# EAGLE design PIC V.1 (EAGLE 9.6.2)
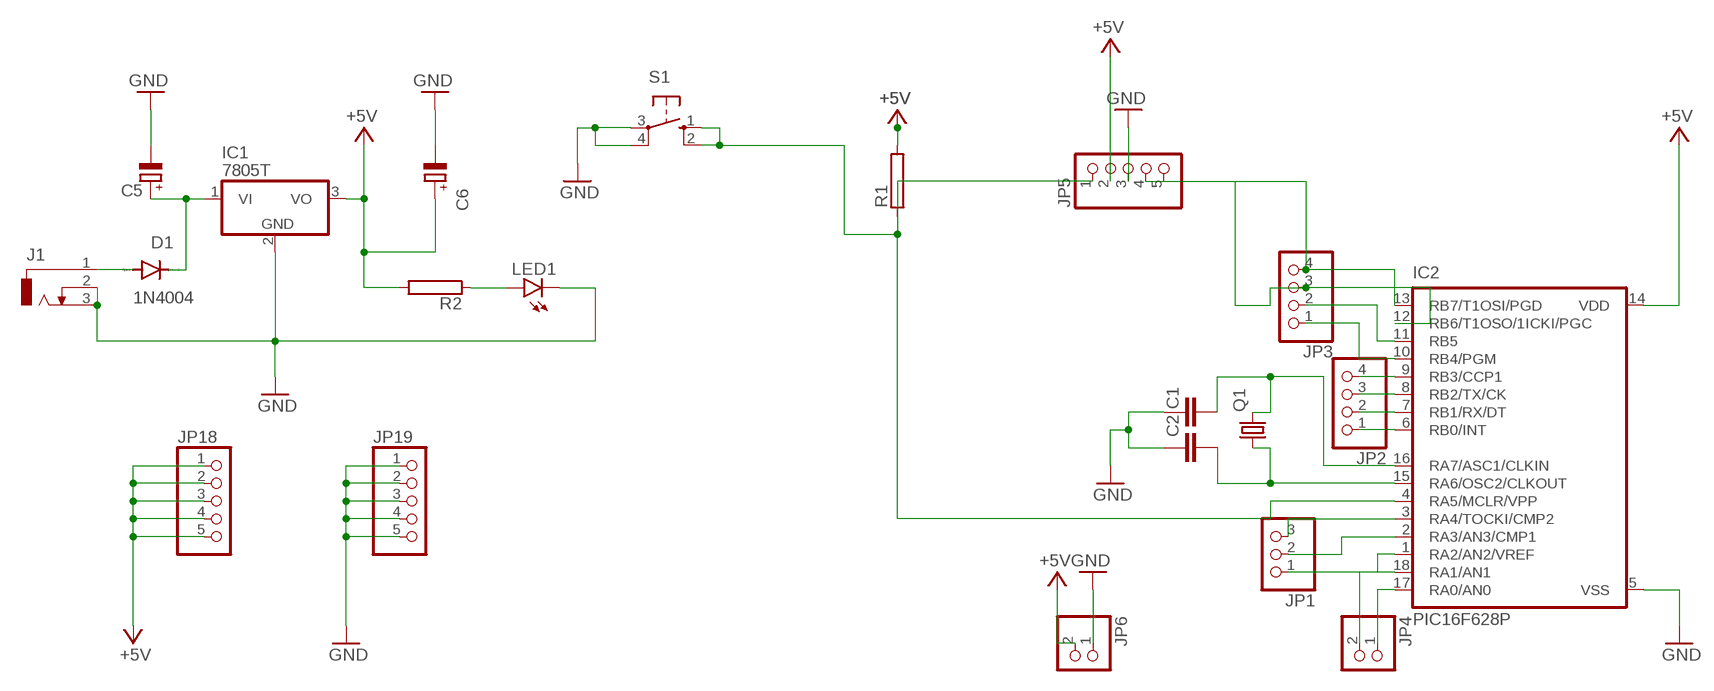
[diagram p0: schematic, sheet 1]

## Parts
C1  C2.5/2  [C2.5-2]
C2  C2.5/2  [C2.5-2]
C5  CPOL-EUE2,5-6E  [E2,5-6E]
C6  CPOL-EUE2,5-6E  [E2,5-6E]
D1  1N4004  [DO41-10]
IC1  7805T  [TO220H]
IC2  PIC16F628P  [DIL18]
J1  DCJ0303  [DCJ0303]
JP1  PINHD-1X3  [1X03]
JP2  PINHD-1X4  [1X04]
JP3  PINHD-1X4  [1X04]
JP4  PINHD-1X2  [1X02]
JP5  PINHD-1X5  [1X05]
JP6  PINHD-1X2  [1X02]
JP18  PINHD-1X5  [1X05]
JP19  PINHD-1X5  [1X05]
LED1  LED5MM  [LED5MM]
Q1  CRYSTALHC49U-V  [HC49U-V]
R1  RRS1/4  [RS1/4]
R2  RRS1/4  [RS1/4]
S1  10-XX  [B3F-10XX]

## Nets
+5V: C6.+ IC1.3(VO) IC2.14(VDD) JP5.2 JP6.2 JP18.1 JP18.2 JP18.3 JP18.4 JP18.5 R1.2 R2.2
GND: C1.1 C2.1 C5.- C6.- IC1.2(GND) IC2.5(VSS) J1.2 J1.3 JP5.3 JP6.1 JP19.1 JP19.2 JP19.3 JP19.4 JP19.5 LED1.K(C) S1.3(P) S1.4(P1)
N$1: IC2.1(RA2/AN2/VREF) JP1.1
N$2: IC2.2(RA3/AN3/CMP1) JP1.2
N$3: IC2.3(RA4/TOCKI/CMP2) JP1.3
N$4: IC2.6(RB0/INT) JP2.1
N$5: IC2.7(RB1/RX/DT) JP2.2
N$6: IC2.8(RB2/TX/CK) JP2.3
N$7: IC2.9(RB3/CCP1) JP2.4
N$8: IC2.10(RB4/PGM) JP3.1
N$9: IC2.11(RB5) JP3.2
N$10: IC2.12(RB6/T1OSO/1ICKI/PGC) JP3.3 JP5.5
N$11: IC2.13(RB7/T1OSI/PGD) JP3.4 JP5.4
N$12: IC2.17(RA0/AN0) JP4.1
N$13: IC2.18(RA1/AN1) JP4.2
N$25: C2.2 IC2.15(RA6/OSC2/CLKOUT) Q1.1
N$26: IC2.4(RA5/MCLR/VPP) JP5.1 R1.1 S1.1(S) S1.2(S1)
N$28: C1.2 IC2.16(RA7/ASC1/CLKIN) Q1.2
N$30: C5.+ D1.C IC1.1(VI)
N$32: LED1.A R2.1
N$33: D1.A J1.1

## Library data of the parts
C1 C2 = capacitor-wima:C: CAPACITOR naming: grid - package width
C5 C6 = rcl:CPOL-EU: POLARIZED CAPACITOR, European symbol; SPICEPREFIX: C
D1 = diode:1N4004: DIODE general purpose rectifier, 1 A
IC1 = linear:78*: Positive VOLTAGE REGULATOR Source: http://cache.national.com/ds/LM/LM78L05.pdf http://www.fairchildsemi.com/ds/LM/LM7805.pdf
IC2 = microchip:PIC16*F62: FLASH-Based 8-Bit CMOS Microcontroller Source: http://ww1.microchip.com/downloads/en/DeviceDoc/40300C.pdf; MF: MICROCHIP; MPN: PIC16F628-20/P; OC_FARNELL: 9760423; OC_NEWARK: 23C4982
J1 = con-jack:DCJ0303: DC POWER JACK Source: DCJ0303.pdf; OC_FARNELL: unknown; OC_NEWARK: unknown
JP1 = pinhead:PINHD-1X3: PIN HEADER
JP2 JP3 = pinhead:PINHD-1X4: PIN HEADER
JP4 JP6 = pinhead:PINHD-1X2: PIN HEADER
JP5 JP18 JP19 = pinhead:PINHD-1X5: PIN HEADER
LED1 = led:LED: LED OSRAM: - CHIPLED LG R971, LG N971, LY N971, LG Q971, LY Q971, LO R971, LY R971 LH N974, LH R974 LS Q976, LO Q976, LY Q976 LO Q996 - Hyper CHIPLED LW Q18S LB Q993, LB Q99A, LB R99A - SideLED LS A670, LO A670, LY A670, LG A670, LP A670 LB A673, LV A673, LT A673, LW A673 LH A674 LY A675 LS A676, LA A676, LO A676, LY A676, LW A676 LS A679, LY A679, LG A679 - Hyper Micro SIDELED® LS Y876, LA Y876, LO Y876, LY Y876 LT Y87S - SmartLED LW L88C, LW L88S LB L89C, LB L89S, LG L890 LS L89K, LO L89K, LY L89K LS L896, LA L896, LO L896, LY L896 - TOPLED LS T670, LO T670, LY T670, LG T670, LP T670 LSG T670, LSP T670, LSY T670, LOP T670, LYG T670 LG T671, LOG T671, LSG T671 LB T673, LV T673, LT T673, LW T673 LH T674 LS T676, LA T676, LO T676, LY T676, LB T676, LH T676, LSB T676, LW T676 LB T67C, LV T67C, LT T67C, LS T67K, LO T67K, LY T67K, LW E67C LS E67B, LA E67B, LO E67B, LY E67B, LB E67C, LV E67C, LT E67C LW T67C LS T679, LY T679, LG T679 LS T770, LO T770, LY T770, LG T770, LP T770 LB T773, LV T773, LT T773, LW T773 LH T774 LS E675, LA E675, LY E675, LS T675 LS T776, LA T776, LO T776, LY T776, LB T776 LHGB T686 LT T68C, LB T68C - Hyper Mini TOPLED® LB M676 - Mini TOPLED Santana® LG M470 LS M47K, LO M47K, LY M47K Source: http://www.osram.convergy.de LUXEON: - LUMILED® LXK2-PW12-R00, LXK2-PW12-S00, LXK2-PW14-U00, LXK2-PW14-V00 LXK2-PM12-R00, LXK2-PM12-S00, LXK2-PM14-U00 LXK2-PE12-Q00, LXK2-PE12-R00, LXK2-PE12-S00, LXK2-PE14-T00, LXK2-PE14-U00 LXK2-PB12-K00, LXK2-PB12-L00, LXK2-PB12-M00, LXK2-PB14-N00, LXK2-PB14-P00, LXK2-PB14-Q00 LXK2-PR12-L00, LXK2-PR12-M00, LXK2-PR14-Q00, LXK2-PR14-R00 LXK2-PD12-Q00, LXK2-PD12-R00, LXK2-PD12-S00 LXK2-PH12-R00, LXK2-PH12-S00 LXK2-PL12-P00, LXK2-PL12-Q00, LXK2-PL12-R00 Source: www.luxeon.com KINGBRIGHT: KA-3528ASYC Source: www.kingbright.com
Q1 = crystal:CRYSTAL: CRYSTAL; OC_FARNELL: 1666969; OC_NEWARK: unknown
R1 R2 = resistor-power:R: Power Resitor; MF: OHMITE; MPN: RRS1K0; OC_FARNELL: unknown; OC_NEWARK: 01F7661
S1 = switch-omron:10-XX: OMRON SWITCH; MPN: B3F-1000; OC_FARNELL: 176432; OC_NEWARK: 36M3542

## Board
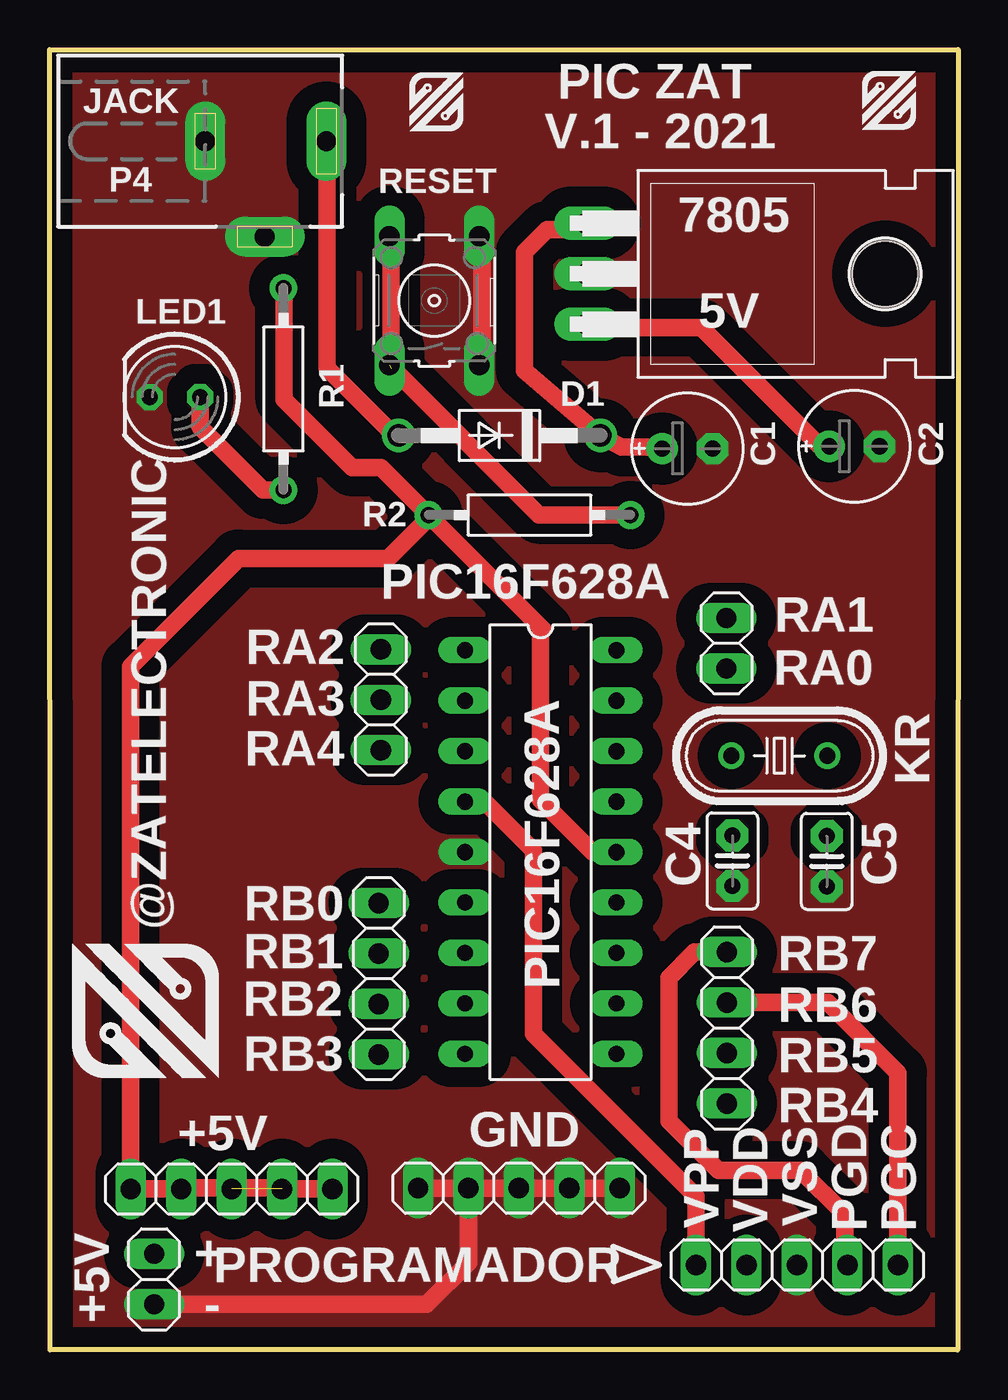
[diagram p1: board, top side]
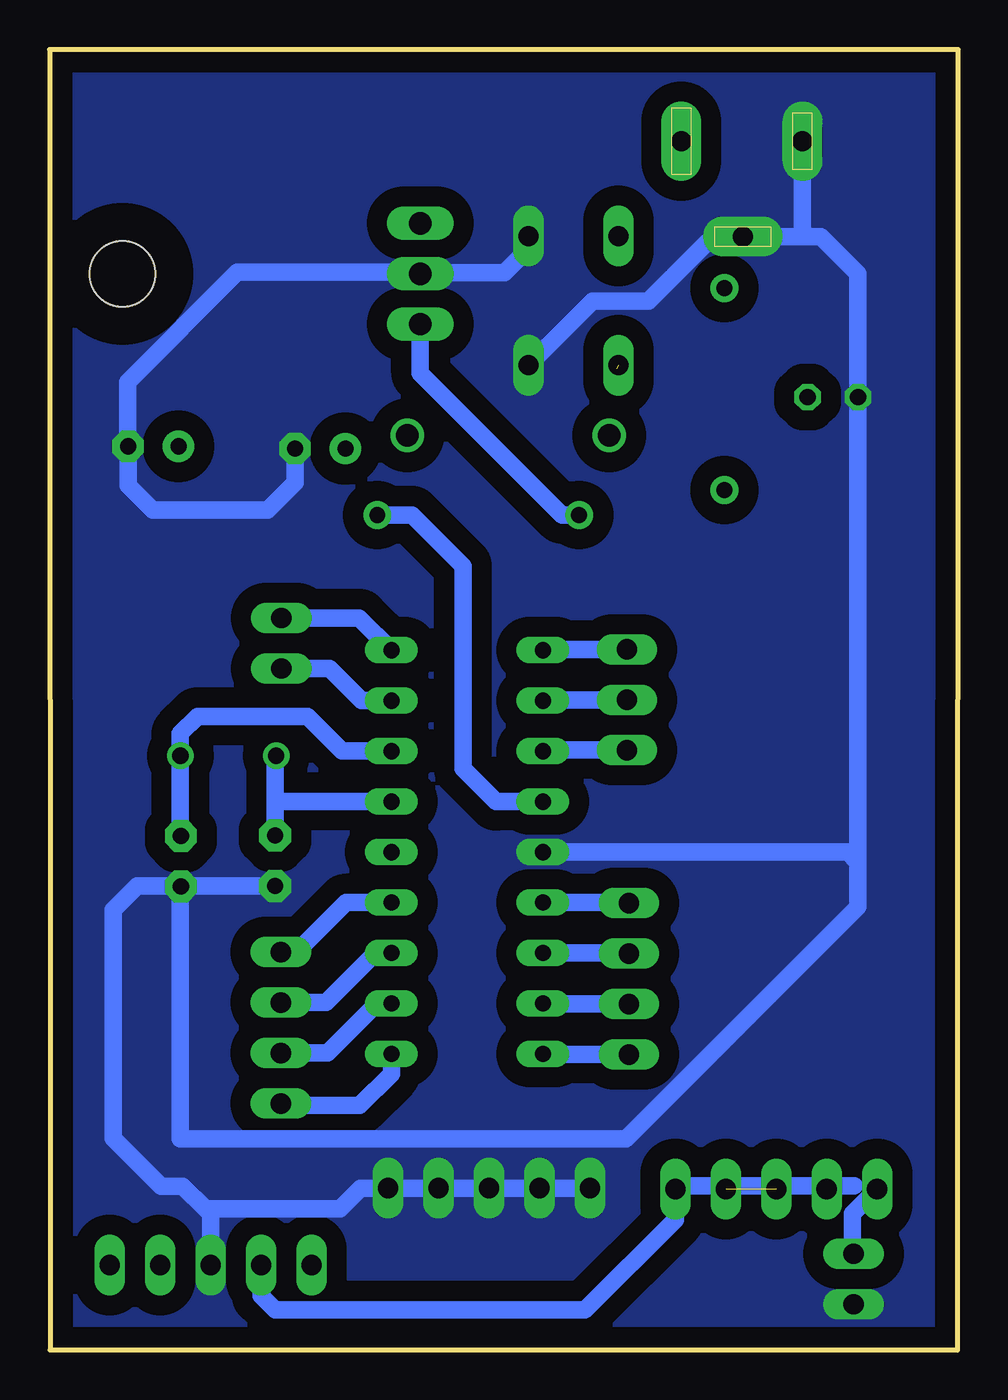
[diagram p2: board, bottom side, seen from below]

Size 45.72 x 65.43 mm. Coordinates in mm from the lower left corner, seen from the top.
Outline: 0,65.43 45.72,65.43 45.69,0 0.03,0 0,65.43
Copper layers (1*16): Top 0.035mm / dielectric 1.5mm / Bottom 0.035mm
Design rules "default *": minimum track width 35mil, minimum drill 0.35mm, track to track 6mil, track to pad 6mil, pad to pad 6mil, via to via 6mil, smd to smd 6mil, copper to edge 40mil, drill to drill 6mil, minimum pad ring 10mil, minimum via ring 8mil, stop-mask expansion 4mil, vias tented up to drill 0mil, thermal gap 10mil

### Footprints (pad centres in the part's own frame; a part is rotated, then mirrored left to right if it is on the bottom)
C2.5-2 = drill 0.813 pad 1.6 octagon: 1 -1.27,0; 2 1.27,0
E2,5-6E = drill 0.813 pad 1.575: + -1.27,0 | drill 0.813 pad 1.575 octagon: - 1.27,0
DO41-10 = drill 1.118: A 5.08,0; C -5.08,0
TO220H = drill 1.118 long: 1 -2.54,-10.16; 2 0,-10.16; 3 2.54,-10.16 | hole 3.302: 0,4.826
DIL18 = drill 0.813 long: 1 -10.16,-3.81; 2 -7.62,-3.81; 3 -5.08,-3.81; 4 -2.54,-3.81; 5 0,-3.81; 6 2.54,-3.81; 7 5.08,-3.81; 8 7.62,-3.81; 9 10.16,-3.81; 10 10.16,3.81; 11 7.62,3.81; 12 5.08,3.81; 13 2.54,3.81; 14 0,3.81; 15 -2.54,3.81; 16 -5.08,3.81; 17 -7.62,3.81; 18 -10.16,3.81
DCJ0303 = drill 1 pad 2 long: 1 0,3.1; 2 4.8,0; 3 0,-3
1X03 = drill 1.016 long: 1 -2.54,0; 2 0,0; 3 2.54,0
1X04 = drill 1.016 long: 1 -3.81,0; 2 -1.27,0; 3 1.27,0; 4 3.81,0
1X02 = drill 1.016 long: 1 -1.27,0; 2 1.27,0
1X05 = drill 1.016 long: 1 -5.08,0; 2 -2.54,0; 3 0,0; 4 2.54,0; 5 5.08,0
LED5MM = drill 0.813 octagon: A -1.27,0; K 1.27,0
HC49U-V = drill 0.813: 1 -2.413,0; 2 2.413,0
RS1/4 = drill 0.8 pad 1.4: 1 -5.08,0; 2 5.08,0
B3F-10XX = drill 1.016 long: 1 -3.251,2.261; 2 3.251,2.261; 3 -3.251,-2.261; 4 3.251,-2.261

### Placement (x,y rotation side)
C1  39.12,24.59 90 top
C2  34.37,24.61 90 top
C5  32.1,45.36 0 top
C6  40.5,45.47 0 top
D1  22.64,46.02 180 top
IC1  37.23,54.15 270 top
IC2  24.71,25.05 270 top
J1  10.83,60.83 270 top
JP1  16.66,32.72 270 top
JP2  16.56,18.67 270 top
JP3  34.09,16.21 90 top
JP4  34.06,35.56 90 top
JP5  37.62,4.27 0 top
JP6  5.26,3.56 90 top
JP18  9.15,8.09 0 top
JP19  23.61,8.14 0 top
LED1  6.3,47.95 180 top
Q1  36.73,29.9 0 top
R1  24.15,42.01 180 top
R2  11.77,48.35 90 top
S1  19.36,52.8 90 top
U$1  [LOGO_ZATELECTRONIC1.25CM]  9.12,13.28 90 top
U$2  [SIMBOLO_PEQUENO]  17.96,61.09 0 top
U$3  [SIMBOLO_PEQUENO]  40.74,61.16 0 top

### Tracks (layer width: path | path; a pad name or v marks a point on that pad's centre or on a via)
+5V  (1 unrouted)
  Top 0.889: R2.2 11.81,53.42 11.81,47.83 15.22,44.41 16.67,44.41 R1.2 | IC1.3 27.25,51.43 32.8,51.43 38.76,45.47 C6.+ | R1.2 19.04,41.98 | 24.84,36.24 24.71,36.37 | 24.71,36.37 R1.2 | JP18.5 JP18.4 11.63,8.15 6.67,8.15 JP18.2 JP18.1 4.07,34.4 9.5,39.83 17.04,39.83 19.07,41.85 R1.2 | IC2.14 27.33,25.05 24.71,27.66 24.71,36.37
  Bottom 0.889: R1.2 19.93,42.02 27.07,49.15 IC1.3 | 5.21,8.25 14.08,8.25 JP18.5 14.23,6.55 18.77,2.01 34.37,2.01 35.08,2.72 JP5.2 | 4.22,8.25 JP18.1 5.32,6.85 5.32,4.88 JP6.2
GND
  Top 0.889: S1.4 21.75,55.92 21.75,49.69 | J1.2 9.64,56.03 | JP19.1 JP19.2 | JP19.2 JP19.3 JP19.4 JP19.5 | JP6.1 18.97,2.29 21.07,4.39 JP19.2
  Bottom 0.889: S1.4 21.62,55.41 22.82,54.21 26.96,54.21 IC1.2 27.14,54.22 36.29,54.22 41.8,48.71 41.8,45.5 C6.- 41.77,43.49 40.53,42.25 34.76,42.25 33.37,43.64 C5.- | S1.3 18.39,52.78 15.58,52.78 12.26,56.1 10.9,56.1 J1.2 7.69,56.03 | 7.69,56.03 6.91,56.03 5.03,54.15 LED1.K 5.03,24.54 | J1.3 7.83,56.17 7.69,56.03 | 5.03,24.54 5.03,22.3 16.71,10.62 39.14,10.62 39.14,23.29 C1.1 39.09,23.34 | IC2.5 5.54,25.05 5.03,24.54 | C2.1 39.09,23.34 | JP5.3 37.62,6.83 37.87,7.09 | 39.09,23.34 41.33,23.34 42.52,22.15 42.52,10.64 40.11,8.23 39.01,8.23 37.87,7.09 | 37.87,7.09 31.12,7.09 30.06,8.14 JP19.5 JP19.1
  pour Bottom (isolate 1.016, no thermals): 0.08,65.61 0.08,-0.2 45.62,-0.2 45.62,65.61
  pour Top (isolate 1.016, no thermals): 0,65.51 0,0.03 45.69,0.03 45.69,65.51
N$1
  Bottom 0.889: JP1.1 20.85,35.26 IC2.1
N$2
  Bottom 0.889: JP1.2 20.85,32.72 IC2.2
N$3
  Bottom 0.889: JP1.3 20.85,30.17 IC2.3
N$4
  Bottom 0.889: IC2.6 16.59,22.51 JP2.1
N$5
  Bottom 0.889: IC2.7 16.59,19.97 JP2.2
N$6
  Bottom 0.889: JP2.3 20.87,17.4 IC2.8
N$7
  Bottom 0.889: JP2.4 20.87,14.86 IC2.9
N$8
  Bottom 0.889: IC2.10 28.52,13.9 30.12,12.29 33.99,12.29 JP3.1
N$9
  Bottom 0.889: IC2.11 29.23,17.43 31.72,14.93 JP3.2
N$10
  Top 0.889: JP5.5 42.7,13.95 39.17,17.48 JP3.3
  Bottom 0.889: IC2.12 29.31,19.97 31.8,17.48 JP3.3
N$11
  Top 0.889: JP5.4 40.02,4.41 40.02,6.81 37.79,9.04 33.66,9.04 31.17,11.53 31.17,18.72 32.46,20.02 JP3.4
  Bottom 0.889: IC2.13 30.81,22.51 33.4,19.91 34.7,19.91 34.59,20.02 JP3.4
N$12
  Bottom 0.889: IC2.17 30.02,32.67 31.64,34.29 34.22,34.29 34.21,34.29 JP4.1
N$13
  Bottom 0.889: IC2.18 30.14,36.83 JP4.2
N$25
  Bottom 0.889: Q1.1 34.37,29.84 34.37,27.69 | 34.37,27.69 C2.2 | IC2.15 34.27,27.59 34.37,27.69
N$26  (1 unrouted)
  Top 0.889: 17.18,49.38 17.18,55.98 S1.2 | 17.27,49.72 S1.1 24.63,42.02 R1.1 | JP5.1 32.54,7.72 24.36,15.9 24.36,25.12 21.89,27.59 IC2.4
  Bottom 0.889: IC2.4 23.24,27.59 24.92,29.26 24.92,39.45 27.49,42.02 R1.1
N$28
  Bottom 0.889: IC2.16 30.99,30.13 32.74,31.88 38.28,31.88 39.14,31.01 Q1.2 39.14,25.88 C1.2
N$30
  Top 0.889: C5.+ 30.83,45.43 28.78,45.43 D1.C 23.9,49.27 23.9,55.24 25.03,56.36 26.82,56.36 IC1.1
N$32
  Top 0.889: R2.1 10.73,43.27 7.57,46.43 LED1.A
N$33
  Top 0.889: D1.A 17.35,46.02 13.96,49.4 13.96,59.81 13.93,59.85 J1.1

### Text on the board
tNames: PIC ZAT | JACK | V.1 - 2021 | P4 | RESET | 7805 | LED1 | 5V | R1 | D1 | C1 | C2 | R2 | PIC16F628A | RA1 | RA2 | RA0 | @ZATELECTRONIC | RA3 | RA4 | KR | PIC16F628A | C4 | C5 | RB0 | RB1 | RB7 | RB2 | RB6 | RB3 | RB5 | RB4 | +5V | GND | VPP | VSS | PGD | PGC | VDD | + | +5V | PROGRAMADOR | -